# Altium schematic sheet 05 CPU.SchDoc
size 420 x 297 mm; Organization: Altium Limited; Address1: L3, 12a Rodborough Rd; Address2: Frenchs Forest; Address3: NSW; Address4: Australia 2086
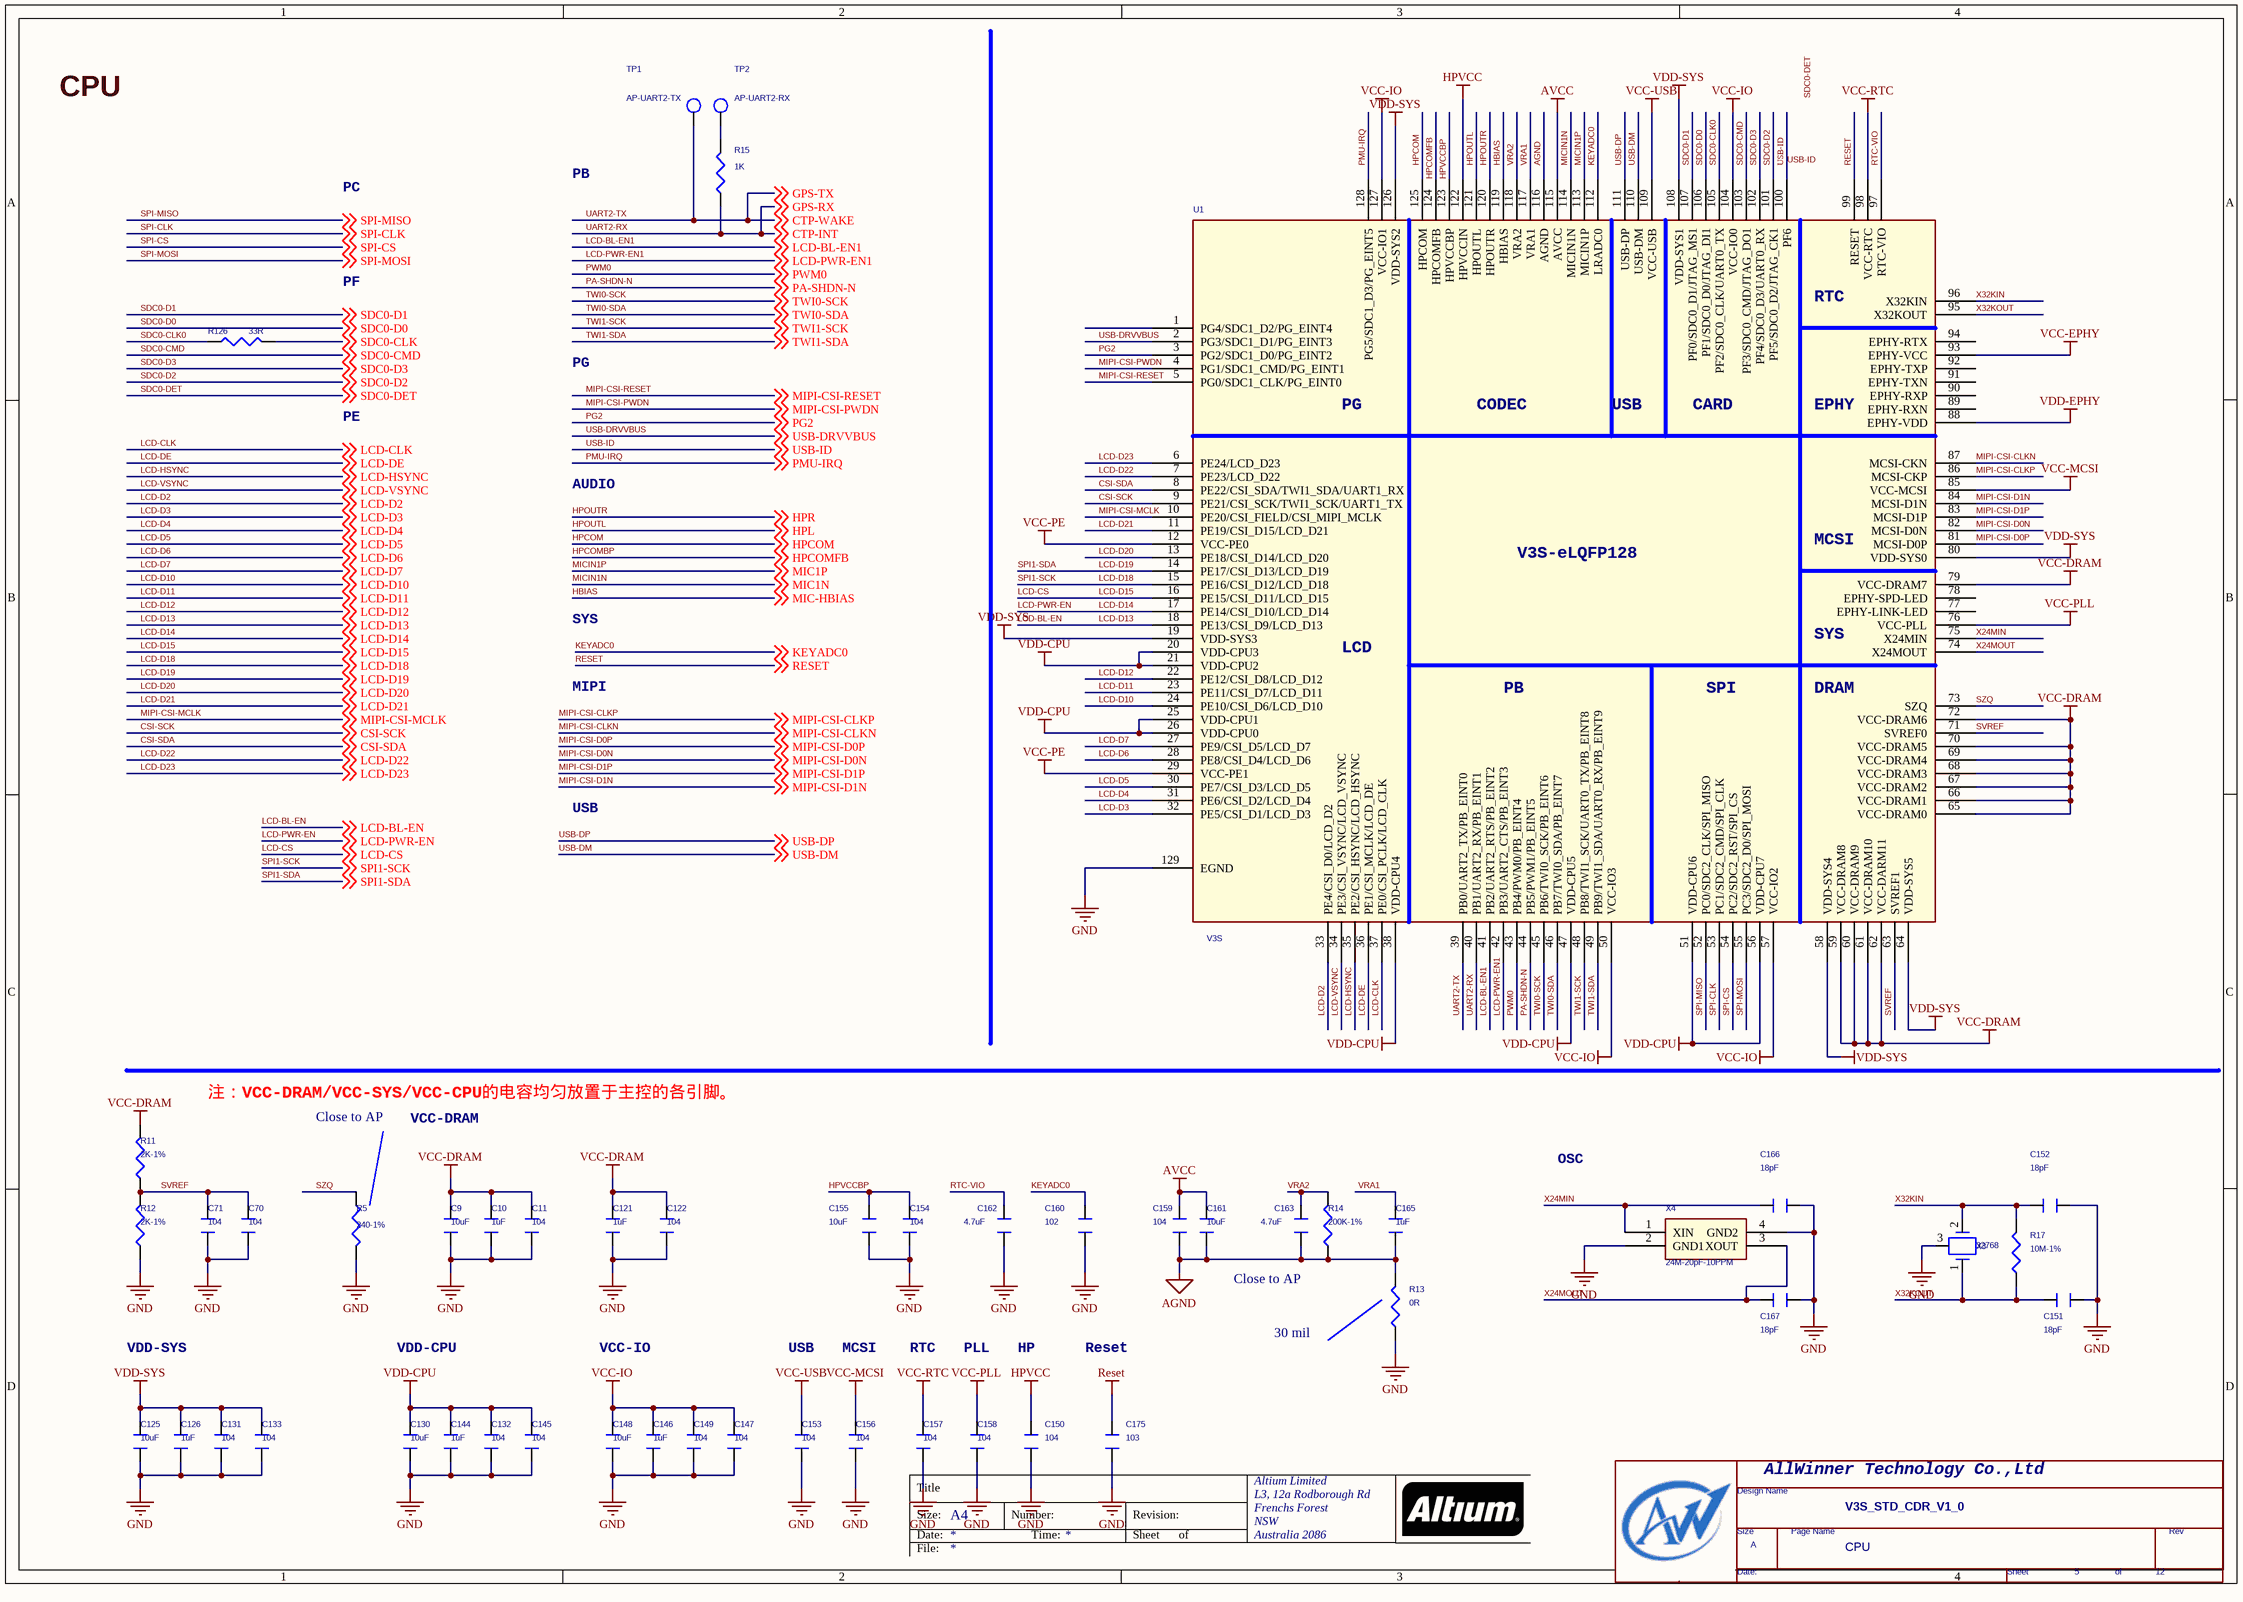
[diagram p0: 05 CPU.SchDoc]

## Parts
*  Page Count: 12  Page Number: 5  Page Size: A  Title: V3S_STD_CDR_V1_0  Doc: CPU  (hidden comment: TitleBlock0-AW)  (graphical)
C9  10uF  [C0603]
C10  1uF  [C0402]
C11  104  [C0402]
C70  104  [C0402]
C71  104  [C0402]
C121  1uF  [C0402]
C122  104  [C0402]
C125  10uF  [C0603]
C126  1uF  [C0402]
C130  10uF  [C0603]
C131  104  [C0402]
C132  104  [C0402]
C133  104  [C0402]
C144  1uF  [C0402]
C145  104  [C0402]
C146  1uF  [C0402]
C147  104  [C0402]
C148  10uF  [C0603]
C149  104  [C0402]
C150  104  [C0402]
C151  18pF  [C0402]
C152  18pF  [C0402]
C153  104  [C0402]
C154  104  [C0402]
C155  10uF  [C0603]
C156  104  [C0402]
C157  104  [C0402]
C158  104  [C0402]
C159  104  [C0402]
C160  102  [C0402]
C161  10uF  [C0603]
C162  4.7uF  [C0402]
C163  4.7uF  [C0402]
C165  1uF  [C0402]
C166  18pF  [C0402]
C167  18pF  [C0402]
C175  103  [C0402]
R5  240-1%  [R0402]
R11  2K-1%  [R0402]
R12  2K-1%  [R0402]
R13  0R  [R0402]
R14  200K-1%  [R0402]
R15  1K  [R0402]
R17  10M-1%  [R0402]
R126  33R  [R0402]
TP1  AP-UART2-TX  [TP_SMD]
TP2  AP-UART2-RX  [TP_SMD]
U1  V3S  [eLPFP128]
X3  32768  [XCOL-3]
X4  24M-20pF-10PPM  [CRY-3225]

## Nets
AGND: C159.1 C161.1 C163.1 C165.1 R13.2 R14.1 U1.116(AGND)
AVCC: C159.2 C161.2 U1.115(AVCC)
GND: C9.1 C10.1 C11.1 C70.1 C71.1 C121.1 C122.1 C125.1 C126.1 C130.1 C131.1 C132.1 C133.1 C144.1 C145.1 C146.1 C147.1 C148.1 C149.1 C150.1 C151.1 C152.1 C153.1 C154.1 C155.1 C156.1 C157.1 C158.1 C160.1 C162.1 C166.1 C167.1 C175.1 R5.2 R12.1 R13.1 U1.129(EGND) X3.3(Shield) X4.2(GND1) X4.4(GND2)
HPVCC: C150.2 U1.122(HPVCCIN)
RESET: C175.2 U1.99(RESET) ; off-sheet RESET
VCC-DRAM: C9.2 C10.2 C11.2 C121.2 C122.2 R11.2 U1.59(VCC-DRAM8) U1.60(VCC-DRAM9) U1.61(VCC-DRAM10) U1.62(VCC-DARM11) U1.65(VCC-DRAM0) U1.66(VCC-DRAM1) U1.67(VCC-DRAM2) U1.68(VCC-DRAM3) U1.69(VCC-DRAM4) U1.70(VCC-DRAM5) U1.72(VCC-DRAM6) U1.79(VCC-DRAM7)
VCC-EPHY: U1.93(EPHY-VCC)
VCC-IO: C146.2 C147.2 C148.2 C149.2 U1.50(VCC-IO3) U1.57(VCC-IO2) U1.104(VCC-IO0) U1.127(VCC-IO1)
VCC-MCSI: C156.2 U1.85(VCC-MCSI)
VCC-PE: U1.12(VCC-PE0) U1.29(VCC-PE1)
VCC-PLL: C158.2 U1.76(VCC-PLL)
VCC-RTC: C157.2 U1.98(VCC-RTC)
VCC-USB: C153.2 U1.109(VCC-USB)
VDD-CPU: C130.2 C132.2 C144.2 C145.2 U1.20(VDD-CPU3) U1.21(VDD-CPU2) U1.25(VDD-CPU1) U1.26(VDD-CPU0) U1.38(VDD-CPU4) U1.47(VDD-CPU5) U1.51(VDD-CPU6) U1.56(VDD-CPU7)
VDD-EPHY: U1.88(EPHY-VDD)
VDD-SYS: C125.2 C126.2 C131.2 C133.2 U1.19(VDD-SYS3) U1.58(VDD-SYS4) U1.64(VDD-SYS5) U1.80(VDD-SYS0) U1.108(VDD-SYS1) U1.126(VDD-SYS2)
CSI-SCK: U1.9(PE21/CSI_SCK/TWI1_SCK/UART1_TX) ; off-sheet CSI-SCK
CSI-SDA: U1.8(PE22/CSI_SDA/TWI1_SDA/UART1_RX) ; off-sheet CSI-SDA
HBIAS: U1.119(HBIAS) ; off-sheet MIC-HBIAS  [also labelled MIC-HBIAS]
HPCOM: U1.125(HPCOM) ; off-sheet HPCOM
HPCOMBP: U1.124(HPCOMFB) ; off-sheet HPCOMFB  [also labelled HPCOMFB]
HPOUTL: U1.121(HPOUTL) ; off-sheet HPL  [also labelled HPL]
HPOUTR: U1.120(HPOUTR) ; off-sheet HPR  [also labelled HPR]
HPVCCBP: C154.2 C155.2 U1.123(HPVCCBP)
KEYADC0: C160.2 U1.112(LRADC0) ; off-sheet KEYADC0
LCD-BL-EN: U1.18(PE13/CSI_D9/LCD_D13) ; off-sheet LCD-D13, off-sheet LCD-BL-EN  [also labelled LCD-D13]
LCD-BL-EN1: U1.41(PB2/UART2_RTS/PB_EINT2) ; off-sheet LCD-BL-EN1
LCD-CLK: U1.37(PE0/CSI_PCLK/LCD_CLK) ; off-sheet LCD-CLK
LCD-CS: U1.16(PE15/CSI_D11/LCD_D15) ; off-sheet LCD-D15, off-sheet LCD-CS  [also labelled LCD-D15]
LCD-D2: U1.33(PE4/CSI_D0/LCD_D2) ; off-sheet LCD-D2
LCD-D3: U1.32(PE5/CSI_D1/LCD_D3) ; off-sheet LCD-D3
LCD-D4: U1.31(PE6/CSI_D2/LCD_D4) ; off-sheet LCD-D4
LCD-D5: U1.30(PE7/CSI_D3/LCD_D5) ; off-sheet LCD-D5
LCD-D6: U1.28(PE8/CSI_D4/LCD_D6) ; off-sheet LCD-D6
LCD-D7: U1.27(PE9/CSI_D5/LCD_D7) ; off-sheet LCD-D7
LCD-D10: U1.24(PE10/CSI_D6/LCD_D10) ; off-sheet LCD-D10
LCD-D11: U1.23(PE11/CSI_D7/LCD_D11) ; off-sheet LCD-D11
LCD-D12: U1.22(PE12/CSI_D8/LCD_D12) ; off-sheet LCD-D12
LCD-D14: U1.17(PE14/CSI_D10/LCD_D14) ; off-sheet LCD-D14, off-sheet LCD-PWR-EN  [also labelled LCD-PWR-EN]
LCD-D18: U1.15(PE16/CSI_D12/LCD_D18) ; off-sheet LCD-D18, off-sheet SPI1-SCK  [also labelled SPI1-SCK]
LCD-D19: U1.14(PE17/CSI_D13/LCD_D19) ; off-sheet LCD-D19, off-sheet SPI1-SDA  [also labelled SPI1-SDA]
LCD-D20: U1.13(PE18/CSI_D14/LCD_D20) ; off-sheet LCD-D20
LCD-D21: U1.11(PE19/CSI_D15/LCD_D21) ; off-sheet LCD-D21
LCD-D22: U1.7(PE23/LCD_D22) ; off-sheet LCD-D22
LCD-D23: U1.6(PE24/LCD_D23) ; off-sheet LCD-D23
LCD-DE: U1.36(PE1/CSI_MCLK/LCD_DE) ; off-sheet LCD-DE
LCD-HSYNC: U1.35(PE2/CSI_HSYNC/LCD_HSYNC) ; off-sheet LCD-HSYNC
LCD-PWR-EN1: U1.42(PB3/UART2_CTS/PB_EINT3) ; off-sheet LCD-PWR-EN1
LCD-VSYNC: U1.34(PE3/CSI_VSYNC/LCD_VSYNC) ; off-sheet LCD-VSYNC
MICIN1N: U1.114(MICIN1N) ; off-sheet MIC1N  [also labelled MIC1N]
MICIN1P: U1.113(MICIN1P) ; off-sheet MIC1P  [also labelled MIC1P]
MIPI-CSI-CLKN: U1.87(MCSI-CKN) ; off-sheet MIPI-CSI-CLKN
MIPI-CSI-CLKP: U1.86(MCSI-CKP) ; off-sheet MIPI-CSI-CLKP
MIPI-CSI-D0N: U1.82(MCSI-D0N) ; off-sheet MIPI-CSI-D0N
MIPI-CSI-D0P: U1.81(MCSI-D0P) ; off-sheet MIPI-CSI-D0P
MIPI-CSI-D1N: U1.84(MCSI-D1N) ; off-sheet MIPI-CSI-D1N
MIPI-CSI-D1P: U1.83(MCSI-D1P) ; off-sheet MIPI-CSI-D1P
MIPI-CSI-MCLK: U1.10(PE20/CSI_FIELD/CSI_MIPI_MCLK) ; off-sheet MIPI-CSI-MCLK
MIPI-CSI-PWDN: U1.4(PG1/SDC1_CMD/PG_EINT1) ; off-sheet MIPI-CSI-PWDN
MIPI-CSI-RESET: U1.5(PG0/SDC1_CLK/PG_EINT0) ; off-sheet MIPI-CSI-RESET
PA-SHDN-N: U1.44(PB5/PWM1/PB_EINT5) ; off-sheet PA-SHDN-N
PG2: U1.3(PG2/SDC1_D0/PG_EINT2) ; off-sheet PG2
PMU-IRQ: U1.128(PG5/SDC1_D3/PG_EINT5) ; off-sheet PMU-IRQ
PWM0: U1.43(PB4/PWM0/PB_EINT4) ; off-sheet PWM0
RTC-VIO: C162.2 U1.97(RTC-VIO)
SDC0-CLK: R126.2 ; off-sheet SDC0-CLK
SDC0-CLK0: R126.1 U1.105(PF2/SDC0_CLK/UART0_TX)
SDC0-CMD: U1.103(PF3/SDC0_CMD/JTAG_DO1) ; off-sheet SDC0-CMD
SDC0-D0: U1.106(PF1/SDC0_D0/JTAG_DI1) ; off-sheet SDC0-D0
SDC0-D1: U1.107(PF0/SDC0_D1/JTAG_MS1) ; off-sheet SDC0-D1
SDC0-D2: U1.101(PF5/SDC0_D2/JTAG_CK1) ; off-sheet SDC0-D2
SDC0-D3: U1.102(PF4/SDC0_D3/UART0_RX) ; off-sheet SDC0-D3
SPI-CLK: U1.53(PC1/SDC2_CMD/SPI_CLK) ; off-sheet SPI-CLK
SPI-CS: U1.54(PC2/SDC2_RST/SPI_CS) ; off-sheet SPI-CS
SPI-MISO: U1.52(PC0/SDC2_CLK/SPI_MISO) ; off-sheet SPI-MISO
SPI-MOSI: U1.55(PC3/SDC2_D0/SPI_MOSI) ; off-sheet SPI-MOSI
SVREF: C70.2 C71.2 R11.1 R12.2 U1.63(SVREF1) U1.71(SVREF0)
SZQ: R5.1 U1.73(SZQ)
TWI0-SCK: U1.45(PB6/TWI0_SCK/PB_EINT6) ; off-sheet TWI0-SCK
TWI0-SDA: U1.46(PB7/TWI0_SDA/PB_EINT7) ; off-sheet TWI0-SDA
TWI1-SCK: U1.48(PB8/TWI1_SCK/UART0_TX/PB_EINT8) ; off-sheet TWI1-SCK
TWI1-SDA: U1.49(PB9/TWI1_SDA/UART0_RX/PB_EINT9) ; off-sheet TWI1-SDA
UART2-RX: R15.1 U1.40(PB1/UART2_RX/PB_EINT1) ; off-sheet CTP-INT, off-sheet GPS-RX  [also labelled CTP-INT, GPS-RX]
UART2-TX: TP1.1(TP) U1.39(PB0/UART2_TX/PB_EINT0) ; off-sheet CTP-WAKE, off-sheet GPS-TX  [also labelled CTP-WAKE, GPS-TX]
USB-DM: U1.110(USB-DM) ; off-sheet USB-DM
USB-DP: U1.111(USB-DP) ; off-sheet USB-DP
USB-DRVVBUS: U1.2(PG3/SDC1_D1/PG_EINT3) ; off-sheet USB-DRVVBUS
USB-ID: U1.100(PF6) ; off-sheet USB-ID
VRA1: C165.2 U1.117(VRA1)
VRA2: C163.2 R14.2 U1.118(VRA2)
X24MIN: C166.2 U1.75(X24MIN) X4.1(XIN)
X24MOUT: C167.2 U1.74(X24MOUT) X4.3(XOUT)
X32KIN: C152.2 R17.2 U1.96(X32KIN) X3.2
X32KOUT: C151.2 R17.1 U1.95(X32KOUT) X3.1
NetR15_2: R15.2 TP2.1(TP)

Not connected (* = marked no-connect by the designer): U1 1(PG4/SDC1_D2/PG_EINT4) 77(EPHY-LINK-LED) 78(EPHY-SPD-LED) 89(EPHY-RXN) 90(EPHY-RXP) 91(EPHY-TXN) 92(EPHY-TXP) 94(EPHY-RTX)

## Notes on the sheet
- CPU
- PC
- PB
- PF
- PG
- PE
- AUDIO
- SYS
- MIPI
- USB
- 注：VCC-DRAM/VCC-SYS/VCC-CPU的电容均匀放置于主控的各引脚。
- Close to AP
- VCC-DRAM
- OSC
- 30 mil
- VDD-SYS
- VDD-CPU
- VCC-IO
- MCSI
- RTC
- PLL
- HP
- Reset
- Labels drawn without touching a wire or pin: SDC0-DET
- Title
- Size:
- Date:
- A4
- Number:
- Time:
- Revision:
- Sheet
- of
- File:
- (in symbol TitleBlock0-AW) AllWinner Technology Co.,Ltd; Design Name; Size; Page Name; Rev; Date:; Sheet; of
- (in symbol V3S_1) RTC; PG; CODEC; USB; CARD; EPHY; MCSI; V3S-eLQFP128; SYS; LCD; PB; SPI; DRAM

## Library data of the parts
C9-C11 C121 C122 C125 C126 C130-C133 C144-C149 C153 C156-C158 = CAPACITOR_0_Dup5
C70 C71 C151 C152 C162 C166 C167 = CAPACITOR_0_Dup5: PAGE: 2
C150 C175 = CAPACITOR_0_Dup5: PAGE: 3
C154 C155 C159 C161 = CAPACITOR_0: PAGE: 2
C160 C163 C165 = CAPACITOR_0
R5 R15 R126 = R_Dup4
R11 R12 = ?_0_Dup1
R13 R14 = R_Dup1
R17 = R_Dup3
TP1 TP2 = T_POINT_R
U1 = V3S_1
X3 = CRYSTAL_XCOL-3
X4 = CRYSTAL-4_0: Crystal 24MHz 20pF 10ppm  -30 to +85; PART NUMBER: 7M24000004; Vendor: TXC; SPREADWIN PN: U3000019A
* = TitleBlock0-AW: Page Create Date: March  8, 1995